# Altium schematic sheet P03.McuPower.SchDoc
size A4
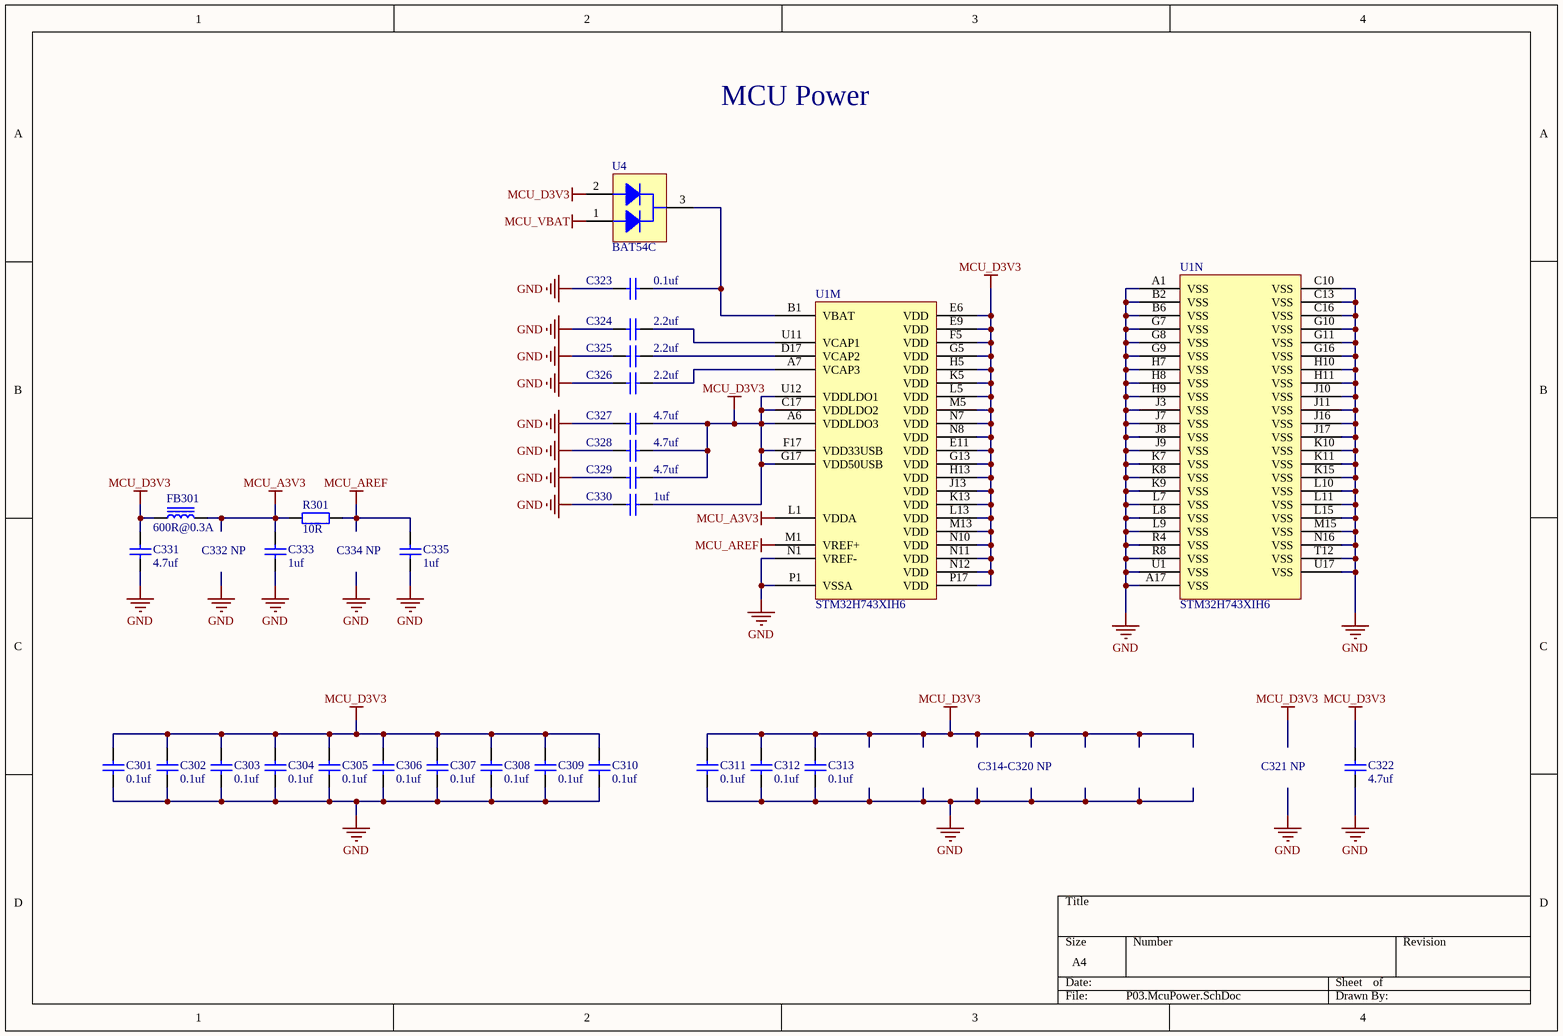
[diagram p0: P03.McuPower.SchDoc]

## Parts
C301  value 0.1uf  [C0402]  (hidden comment: Cap)
C302  value 0.1uf  [C0402]  (hidden comment: Cap)
C303  value 0.1uf  [C0402]  (hidden comment: Cap)
C304  value 0.1uf  [C0402]  (hidden comment: Cap)
C305  value 0.1uf  [C0402]  (hidden comment: Cap)
C306  value 0.1uf  [C0402]  (hidden comment: Cap)
C307  value 0.1uf  [C0402]  (hidden comment: Cap)
C308  value 0.1uf  [C0402]  (hidden comment: Cap)
C309  value 0.1uf  [C0402]  (hidden comment: Cap)
C310  value 0.1uf  [C0402]  (hidden comment: Cap)
C311  value 0.1uf  [C0402]  (hidden comment: Cap)
C312  value 0.1uf  [C0402]  (hidden comment: Cap)
C313  value 0.1uf  [C0402]  (hidden comment: Cap)
C322  value 4.7uf  [C0603]  (hidden comment: Cap)
C323  value 0.1uf  [C0402]  (hidden comment: Cap)
C324  value 2.2uf  [C0402]  (hidden comment: Cap)
C325  value 2.2uf  [C0402]  (hidden comment: Cap)
C326  value 2.2uf  [C0402]  (hidden comment: Cap)
C327  value 4.7uf  [C0402]  (hidden comment: Cap)
C328  value 4.7uf  [C0402]  (hidden comment: Cap)
C329  value 4.7uf  [C0402]  (hidden comment: Cap)
C330  value 1uf  [C0402]  (hidden comment: Cap)
C331  value 4.7uf  [C0402]  (hidden comment: Cap)
C333  value 1uf  [C0402]  (hidden comment: Cap)
C335  value 1uf  [C0402]  (hidden comment: Cap)
FB301  value 600R@0.3A  [FB0402]  (hidden comment: Ferrite Bead)
R301  value 10R  [R0402]  (hidden comment: Res)
U1  STM32H743XIH6  [STM32H743XIH6-TFBGA240+25]  (parts M,N of 14)
U4  BAT54C  [BAT54X-SOT23]

## Nets
GND: C301.1 C302.1 C303.1 C304.1 C305.1 C306.1 C307.1 C308.1 C309.1 C310.1 C311.1 C312.1 C313.1 C322.1 C323.1 C324.1 C325.1 C326.1 C327.1 C328.1 C329.1 C330.1 C331.1 C333.1 C335.1 U1.A1(VSS) U1.A17(VSS) U1.B2(VSS) U1.B6(VSS) U1.C10(VSS) U1.C13(VSS) U1.C16(VSS) U1.G7(VSS) U1.G8(VSS) U1.G9(VSS) U1.G10(VSS) U1.G11(VSS) U1.G16(VSS) U1.H7(VSS) U1.H8(VSS) U1.H9(VSS) U1.H10(VSS) U1.H11(VSS) U1.J3(VSS) U1.J7(VSS) U1.J8(VSS) U1.J9(VSS) U1.J10(VSS) U1.J11(VSS) U1.J16(VSS) U1.J17(VSS) U1.K7(VSS) U1.K8(VSS) U1.K9(VSS) U1.K10(VSS) U1.K11(VSS) U1.K15(VSS) U1.L7(VSS) U1.L8(VSS) U1.L9(VSS) U1.L10(VSS) U1.L11(VSS) U1.L15(VSS) U1.M15(VSS) U1.N1(VREF-) U1.N16(VSS) U1.P1(VSSA) U1.R4(VSS) U1.R8(VSS) U1.T12(VSS) U1.U1(VSS) U1.U17(VSS)
MCU_A3V3: C333.2 FB301.2 R301.1 U1.L1(VDDA)
MCU_AREF: C335.2 R301.2 U1.M1(VREF+)
MCU_D3V3: C301.2 C302.2 C303.2 C304.2 C305.2 C306.2 C307.2 C308.2 C309.2 C310.2 C311.2 C312.2 C313.2 C322.2 C327.2 C328.2 C329.2 C330.2 C331.2 FB301.1 U1.A6(VDDLDO3) U1.C17(VDDLDO2) U1.E6(VDD) U1.E9(VDD) U1.E11(VDD) U1.F5(VDD) U1.F17(VDD33USB) U1.G5(VDD) U1.G13(VDD) U1.G17(VDD50USB) U1.H5(VDD) U1.H13(VDD) U1.J13(VDD) U1.K5(VDD) U1.K13(VDD) U1.L5(VDD) U1.L13(VDD) U1.M5(VDD) U1.M13(VDD) U1.N7(VDD) U1.N8(VDD) U1.N10(VDD) U1.N11(VDD) U1.N12(VDD) U1.P17(VDD) U1.U12(VDDLDO1) U4.2
MCU_VBAT: U4.1
NetC323_2: C323.2 U1.B1(VBAT) U4.3
NetC324_2: C324.2 U1.U11(VCAP1)
NetC325_2: C325.2 U1.D17(VCAP2)
NetC326_2: C326.2 U1.A7(VCAP3)

## Notes on the sheet
- MCU Power
- C332 NP
- C334 NP
- C314-C320 NP
- (near C322) C321 NP

## Library data of the parts
R301 = Res: 电阻
U1 = STM32H743XIH6: 32-bit Arm® Cortex®-M7 480MHz MCUs, up to 2MB Flash,up to 1MB RAM, 46 com. and analog interfaces
U4 = BAT54C: Schottky barrier diodes